# EAGLE design esp32_power_supply (EAGLE 9.6.2)
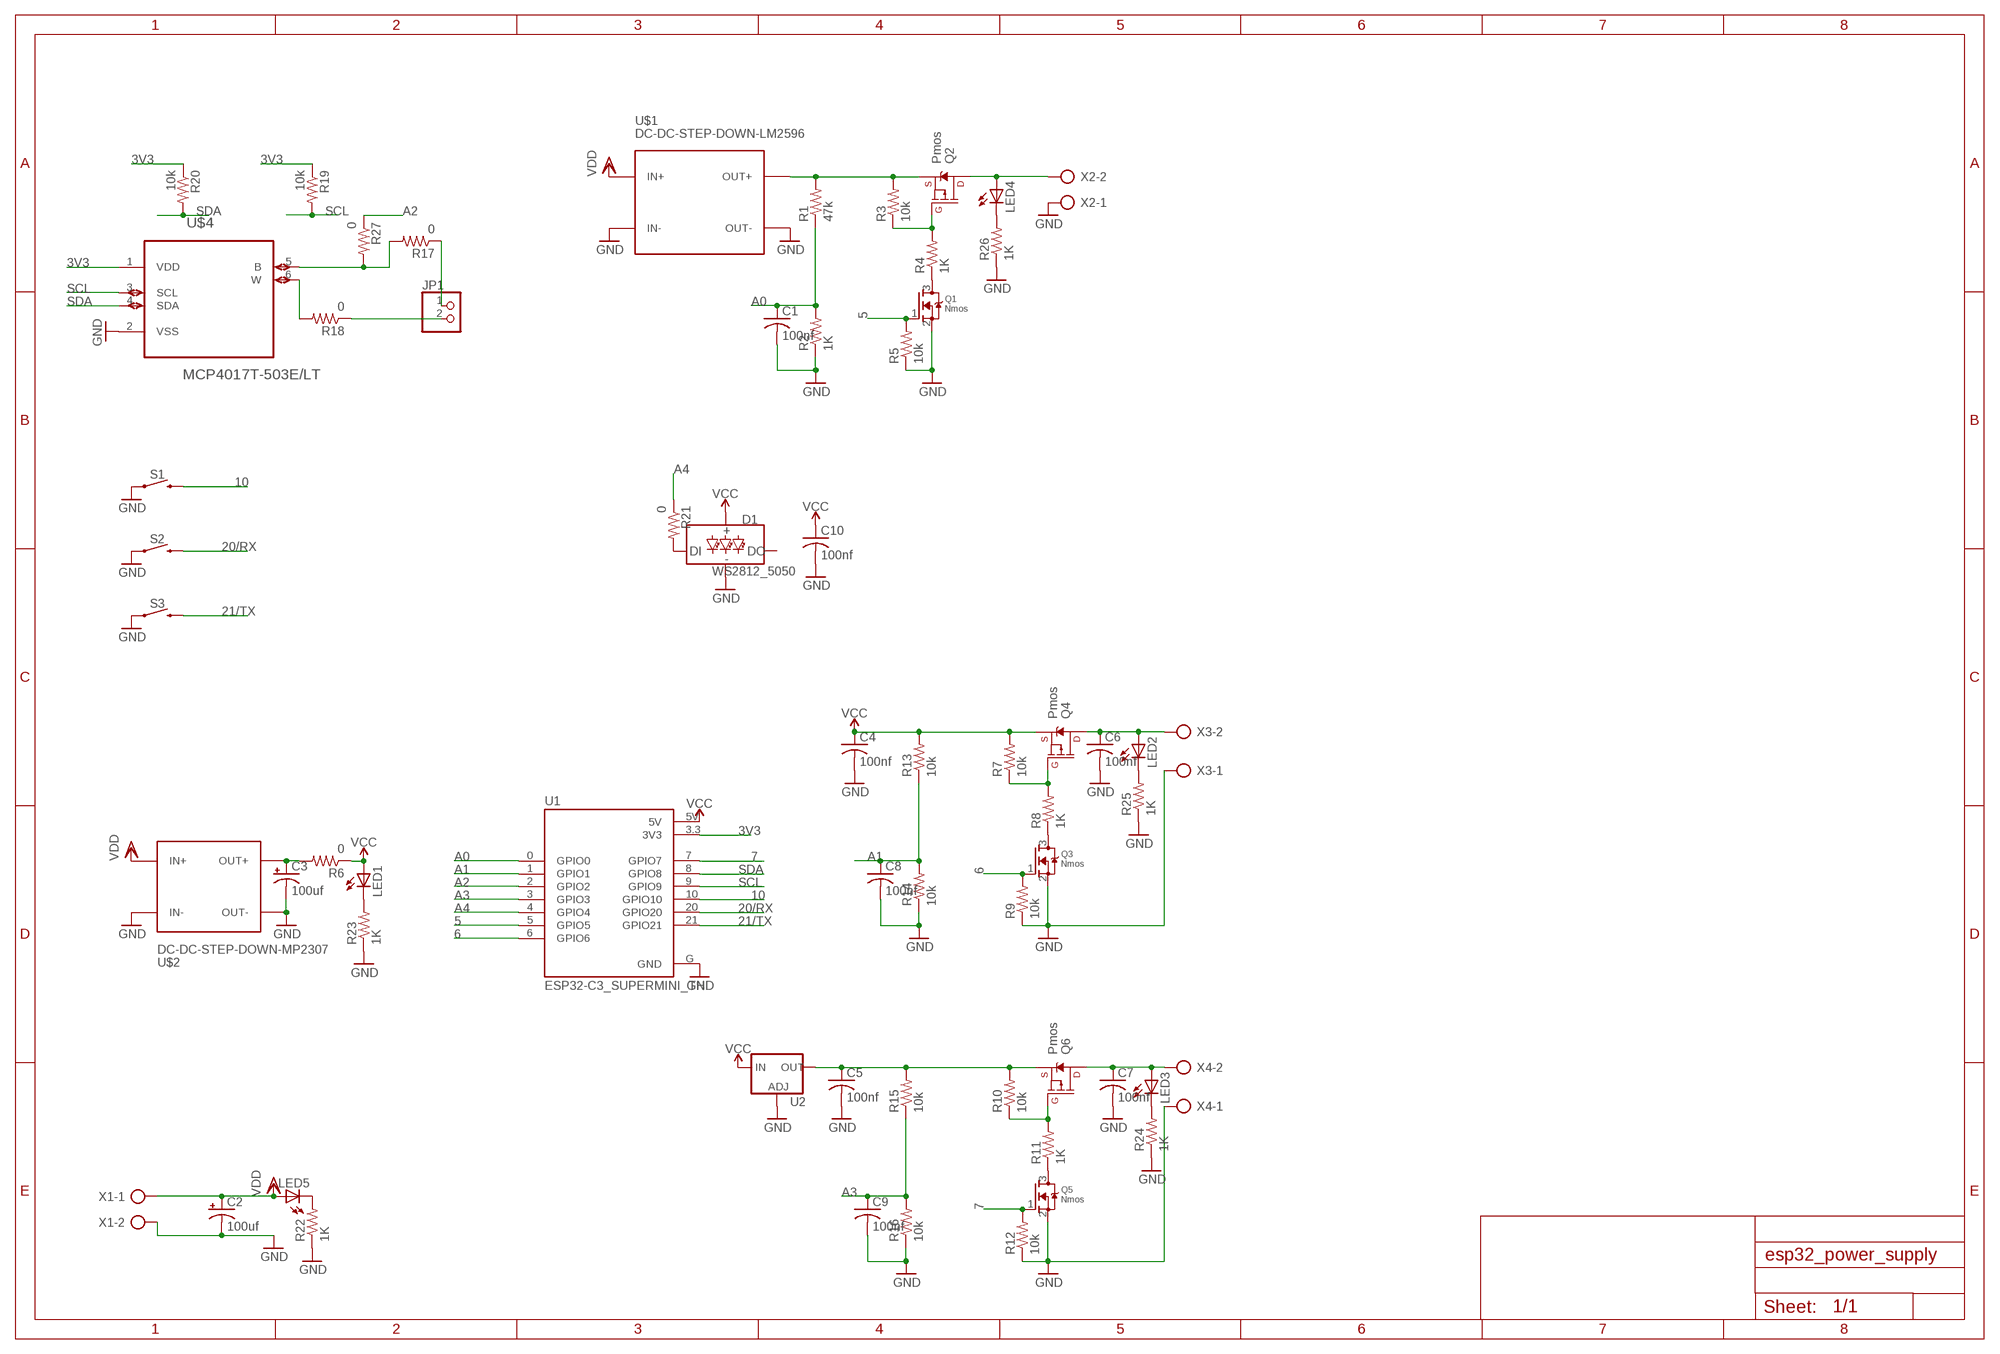
[diagram p0: schematic, sheet 1]

## Parts
C1  100nf  C-USC1206K  [C1206K]
C2  100uf  CPOL-USE3.5-10  [E3,5-10]
C3  100uf  CPOL-USE3.5-10  [E3,5-10]
C4  100nf  C-USC1206K  [C1206K]
C5  100nf  C-USC1206K  [C1206K]
C6  100nf  C-USC1206K  [C1206K]
C7  100nf  C-USC1206K  [C1206K]
C8  100nf  C-USC1206K  [C1206K]
C9  100nf  C-USC1206K  [C1206K]
C10  100nf  C-USC1206K  [C1206K]
D1  WS2812_5050  [WS2812-5X5-4PIN]
JP1  PINHD-1X2  [1X02]
LED1  LEDSMT1206  [1206]
LED2  LEDSMT1206  [1206]
LED3  LEDSMT1206  [1206]
LED4  LEDSMT1206  [1206]
LED5  LEDSMT1206  [1206]
Q1  Nmos  MOSFET-NREFLOW  [SOT23]
Q2  Pmos  MOSFET_PCH-SI2309DS  [SOT23-3]
Q3  Nmos  MOSFET-NREFLOW  [SOT23]
Q4  Pmos  MOSFET_PCH-SI2309DS  [SOT23-3]
Q5  Nmos  MOSFET-NREFLOW  [SOT23]
Q6  Pmos  MOSFET_PCH-SI2309DS  [SOT23-3]
R1  47k  R-US_M1206  [M1206]
R2  1K  R-US_M1206  [M1206]
R3  10k  R-US_M1206  [M1206]
R4  1K  R-US_M1206  [M1206]
R5  10k  R-US_M1206  [M1206]
R6  0  R-US_M1206  [M1206]
R7  10k  R-US_M1206  [M1206]
R8  1K  R-US_M1206  [M1206]
R9  10k  R-US_M1206  [M1206]
R10  10k  R-US_M1206  [M1206]
R11  1K  R-US_M1206  [M1206]
R12  10k  R-US_M1206  [M1206]
R13  10k  R-US_M1206  [M1206]
R14  10k  R-US_M1206  [M1206]
R15  10k  R-US_M1206  [M1206]
R16  10k  R-US_M1206  [M1206]
R17  0  R-US_M1206  [M1206]
R18  0  R-US_M1206  [M1206]
R19  10k  R-US_M1206  [M1206]
R20  10k  R-US_M1206  [M1206]
R21  0  R-US_M1206  [M1206]
R22  1K  R-US_M1206  [M1206]
R23  1K  R-US_M1206  [M1206]
R24  1K  R-US_M1206  [M1206]
R25  1K  R-US_M1206  [M1206]
R26  1K  R-US_M1206  [M1206]
R27  0  R-US_M1206  [M1206]
S1  MOMENTARY-SWITCH-SPST-PTH-6.0MM  [TACTILE_SWITCH_PTH_6.0MM]
S2  MOMENTARY-SWITCH-SPST-PTH-6.0MM  [TACTILE_SWITCH_PTH_6.0MM]
S3  MOMENTARY-SWITCH-SPST-PTH-6.0MM  [TACTILE_SWITCH_PTH_6.0MM]
U1  ESP32-C3_SUPERMINI_TH  [MODULE_ESP32-C3_SUPERMINI_TH]
U2  V_REG_LM1117SOT223  [SOT223]
U$1  DC-DC-STEP-DOWN-LM2596  [DC-DC-STEP-DOWN-LM2596]
U$2  DC-DC-STEP-DOWN-MP2307  [DC-DC-STEP-DOWN-MP2307]
U$4  MCP4017T-503E/LT  [SOT65P210X110-6N]
X1  AK500/2-H  [AK500/2-H]
X2  AK500/2-H  [AK500/2-H]
X3  AK500/2-H  [AK500/2-H]
X4  AK500/2-H  [AK500/2-H]

## Nets
3V3: R19.1 R20.1 U1.3.3(3V3) U$4.1(VDD)
5: Q1.1(G) R5.2 U1.5(GPIO5)
6: Q3.1(G) R9.2 U1.6(GPIO6)
7: Q5.1(G) R12.2 U1.7(GPIO7)
10: S1.3 U1.10(GPIO10)
20/RX: S2.3 U1.20(GPIO20)
21/TX: S3.3 U1.21(GPIO21)
A0: C1.1 R1.1 R2.2 U1.0(GPIO0)
A1: C8.1 R13.1 R14.2 U1.1(GPIO1)
A2: R27.1 U1.2(GPIO2)
A3: C9.1 R15.1 R16.2 U1.3(GPIO3)
A4: R21.1 U1.4(GPIO4)
GND: C1.2 C2.- C3.- C4.2 C5.2 C6.2 C7.2 C8.2 C9.2 C10.2 D1.GND Q1.2(S) Q3.2(S) Q5.2(S) R2.1 R5.1 R9.1 R12.1 R14.1 R16.1 R22.1 R23.1 R24.1 R25.1 R26.1 S1.1 S2.1 S3.1 U1.G(GND) U2.1(ADJ) U$1.IN- U$1.OUT- U$2.IN- U$2.OUT- U$4.2(VSS) X1.2 X2.1 X3.1 X4.1
N$1: Q2.2(S) R1.2 R3.2 U$1.OUT+
N$2: D1.DI R21.2
N$3: Q2.1(G) R3.1 R4.2
N$4: LED4.A Q2.3(D) X2.2
N$5: Q1.3(D) R4.1
N$6: LED5.C R22.2
N$7: C3.+ R6.2 U$2.OUT+
N$8: LED1.C R23.2
N$9: Q4.1(G) R7.1 R8.2
N$10: C6.1 LED2.A Q4.3(D) X3.2
N$11: Q3.3(D) R8.1
N$12: LED3.C R24.2
N$13: C5.1 Q6.2(S) R10.2 R15.2 U2.2(OUT) U2.4(OUT)
N$14: Q6.1(G) R10.1 R11.2
N$15: C7.1 LED3.A Q6.3(D) X4.2
N$16: Q5.3(D) R11.1
N$17: LED2.C R25.2
N$18: LED4.C R26.2
N$19: R17.2 R27.2 U$4.5(B)
N$22: R18.2 U$4.6(W)
N$24: JP1.1 R17.1
N$25: JP1.2 R18.1
SCL: R19.2 U1.9(GPIO9) U$4.3(SCL)
SDA: R20.2 U1.8(GPIO8) U$4.4(SDA)
VCC: C4.1 C10.1 D1.VCC LED1.A Q4.2(S) R6.1 R7.2 R13.2 U1.5V U2.3(IN)
VDD: C2.+ LED5.A U$1.IN+ U$2.IN+ X1.1
Unconnected: D1.DO

## Library data of the parts
C1 C4-C10 = adafruit:C-US: CAPACITOR, American symbol
C2 C3 = adafruit:CPOL-US: POLARIZED CAPACITOR, American symbol
D1 = SparkFun-LED:WS2812: Addressable RGB LED - 1 Wire Common names: WS2812, SK6812, Neopixel, APA-106, etc. SMD LED with built-in controller IC. Color: Red/Green/Blue SparkFun Products: LED-SMD RGB (WS2812) <https://www.sparkfun.com/products/11821> LED - RGB Addressable, PTH, 5mm Diffused (5 Pack) <https://www.sparkfun.com/products/12986> LED - RGB Addressable, PTH, 5mm Clear (5 Pack) <https://www.sparkfun.com/products/12999> Blynk Board - ESP8266 <https://www.sparkfun.com/products/13794> Datasheet referenced for footprint: WS2812B-PTH <https://cdn.sparkfun.com/datasheets/Components/LED/COM-12877.pdf>; PROD_ID: DIO-12503
JP1 = pinhead:PINHD-1X2: PIN HEADER
LED1-LED5 = adafruit:LED: LED OSRAM: - CHIPLED LG R971, LG N971, LY N971, LG Q971, LY Q971, LO R971, LY R971 LH N974, LH R974 LS Q976, LO Q976, LY Q976 LO Q996 - Hyper CHIPLED LW Q18S LB Q993, LB Q99A, LB R99A - SideLED LS A670, LO A670, LY A670, LG A670, LP A670 LB A673, LV A673, LT A673, LW A673 LH A674 LY A675 LS A676, LA A676, LO A676, LY A676, LW A676 LS A679, LY A679, LG A679 - Hyper Micro SIDELED® LS Y876, LA Y876, LO Y876, LY Y876 LT Y87S - SmartLED LW L88C, LW L88S LB L89C, LB L89S, LG L890 LS L89K, LO L89K, LY L89K LS L896, LA L896, LO L896, LY L896 - TOPLED LS T670, LO T670, LY T670, LG T670, LP T670 LSG T670, LSP T670, LSY T670, LOP T670, LYG T670 LG T671, LOG T671, LSG T671 LB T673, LV T673, LT T673, LW T673 LH T674 LS T676, LA T676, LO T676, LY T676, LB T676, LH T676, LSB T676, LW T676 LB T67C, LV T67C, LT T67C, LS T67K, LO T67K, LY T67K, LW E67C LS E67B, LA E67B, LO E67B, LY E67B, LB E67C, LV E67C, LT E67C LW T67C LS T679, LY T679, LG T679 LS T770, LO T770, LY T770, LG T770, LP T770 LB T773, LV T773, LT T773, LW T773 LH T774 LS E675, LA E675, LY E675, LS T675 LS T776, LA T776, LO T776, LY T776, LB T776 LHGB T686 LT T68C, LB T68C - Hyper Mini TOPLED® LB M676 - Mini TOPLED Santana® LG M470 LS M47K, LO M47K, LY M47K Source: http://www.osram.convergy.de/
Q1 Q3 Q5 = adafruit:MOSFET-N: N-Channel Mosfet 2N7002E - 60V 260mA SOT23 [Digikey: 2N7002ET1GOSTR-ND] - REEL BSH103 - 30V 850mA SOT23 [Digikey: 568-5013-1-ND]
Q2 Q4 Q6 = SparkFun-DiscreteSemi:MOSFET_PCH: P-channel MOSFETs Voltage controlled devices that allow control of high current outputs. SparkFun Products: SparkFun ESP32 Thing <https://www.sparkfun.com/products/13907> SparkFun ESP8266 Thing <https://www.sparkfun.com/products/13231> SparkFun Pi Servo HAT V2 <https://www.sparkfun.com/products/15316> DMG2305UX-7 (20V/4.2A/SOT23-3); PROD_ID: TRANS-08285; VALUE: 1.1A/60V/600mΩ
R1-R27 = adafruit:R-US_: RESISTOR, American symbol
S1-S3 = SparkFun-Switches:MOMENTARY-SWITCH-SPST: Momentary Switch (Pushbutton) - SPST Normally-open (NO) SPST momentary switches (buttons, pushbuttons). Variants PTH-12MM - 12mm square, through-hole Momentary Pushbutton Switch - 12mm Square <https://www.sparkfun.com/products/9190> (COM-09190) PTH-6.0MM, PTH-6.0MM-KIT - 6.0mm square, through-hole Mini Pushbutton Switch <https://www.sparkfun.com/products/97> (COM-00097) KIT package intended for soldering kit's - only one side of pads' copper is exposed. PTH-RIGHT-ANGLE-KIT - Right-angle, through-hole Right Angle Tactile Button <https://www.sparkfun.com/products/10791> - Used on SparkFun BigTime Watch Kit <https://www.sparkfun.com/products/11734> SMD-12MM - 12mm square, surface-mount Tactile Button - SMD (12mm) <https://www.sparkfun.com/products/12993> (COM-12993) Used on SparkFun PicoBoard <https://www.sparkfun.com/products/11888> SMD-4.5MM - 4.5mm Square Trackball Switch Used on SparkFun Blackberry Trackballer Breakout <https://www.sparkfun.com/products/13169> SMD-4.6MMX2.8MM - 4.60mm x 2.80mm, surface mount Used on SparkFun Pro Micro - RP2040 <https://www.sparkfun.com/products/17717> SMD-5.2MM, SMD-5.2-REDUNDANT - 5.2mm square, surface-mount Mini Pushbutton Switch - SMD <https://www.sparkfun.com/products/8720> (COM-08720) Used on Arduino Pro Mini <https://www.sparkfun.com/products/11114> REDUNDANT package connects both switch circuits together SMD-6.0X3.5MM - 6.0 x 3.5mm, surface mount Momentary Reset Switch SMD <https://www.sparkfun.com/products/8229> (COM-08229) SMD-6.2MM-TALL - 6.2mm square, surface mount Tactile Button - SMD (6mm) <https://www.sparkfun.com/products/12992> Used on SparkFun Digital Sandbox <https://www.sparkfun.com/products/12651> SMD-RIGHT-ANGLE - Right-angle, surface mount Used on SparkFun Block for Intel® Edison - Arduino <https://www.sparkfun.com/products/13036>; PROD_ID: SWCH-08441; SF_SKU: COM-00097
U1 = ESP32-C3_SUPERMINI_TH:ESP32-C3_SUPERMINI_TH: Check availability <https://pricing.snapeda.com/parts/ESP32-C3%20SuperMini_TH/Espressif%20Systems/view-part?ref=eda>; AVAILABILITY: Not in stock; CHECK_PRICES: https://www.snapeda.com/parts/ESP32-C3%20SuperMini_TH/Espressif+Systems/view-part/?ref=eda; DESCRIPTION: Super tiny ESP32-C3 board; MF: Espressif Systems; MP: ESP32-C3 SuperMini_TH; PACKAGE: Package; PRICE: None; SNAPEDA_LINK: https://www.snapeda.com/parts/ESP32-C3%20SuperMini_TH/Espressif+Systems/view-part/?ref=snap
U2 = SparkFun-IC-Power:V_REG_LM1117: Voltage Regulator LM1117 Standard adjustable voltage regulator but in SMD form. Spark Fun Electronics SKU : COM-00595; PROD_ID: VREG-08170
U$1 = diy-modules:DC-DC-STEP-DOWN-LM2596: DC/DC Step-Down Regulator based on LM2596-ADJ chip LM2596 datasheet available here: http://www.ti.com/lit/ds/symlink/lm2596.pdf Click here to find device on ebay.com <http://www.ebay.com/sch/lm2596+power+regulator>
U$2 = diy-modules:DC-DC-STEP-DOWN-MP2307: DC/DC Step-Down Regulator based on MP2307DN chip MP2307 datasheet available here: https://cdn-shop.adafruit.com/datasheets/MP2307_r1.9.pdf Click here to find device on ebay.com <http://www.ebay.com/sch/dc+dc+3a+mini+converter>
U$4 = MCP4017T-503E_LT:MCP4017T-503E/LT: Check availability <https://pricing.snapeda.com/parts/MCP4017T-503E/LT/Microchip/view-part?ref=eda>; AVAILABILITY: In Stock; CHECK_PRICES: https://www.snapeda.com/parts/MCP4017T-503E/LT/Microchip+Technology/view-part/?ref=eda; DESCRIPTION: MCP4017T-503E/LT,Digi Potentiometer 50kOhm 128-Pos Linear Serial-I2C 6-Pin SC-70 | Microchip Technology Inc. MCP4017T-503E/LT; MF: Microchip; MP: MCP4017T-503E/LT; PACKAGE: SC-70 Microchip; PRICE: None; SNAPEDA_LINK: https://www.snapeda.com/parts/MCP4017T-503E/LT/Microchip+Technology/view-part/?ref=snap
X1-X4 = con-ptr500:AK500/2-H: CONNECTOR Aug. 2004 / PTR Meßtechnik: Die Bezeichnung der Serie AK505 wurde geändert. Es handelt sich hierbei um AK500 in horizontaler Ausführung.; OC_FARNELL: unknown; OC_NEWARK: unknown

## Board
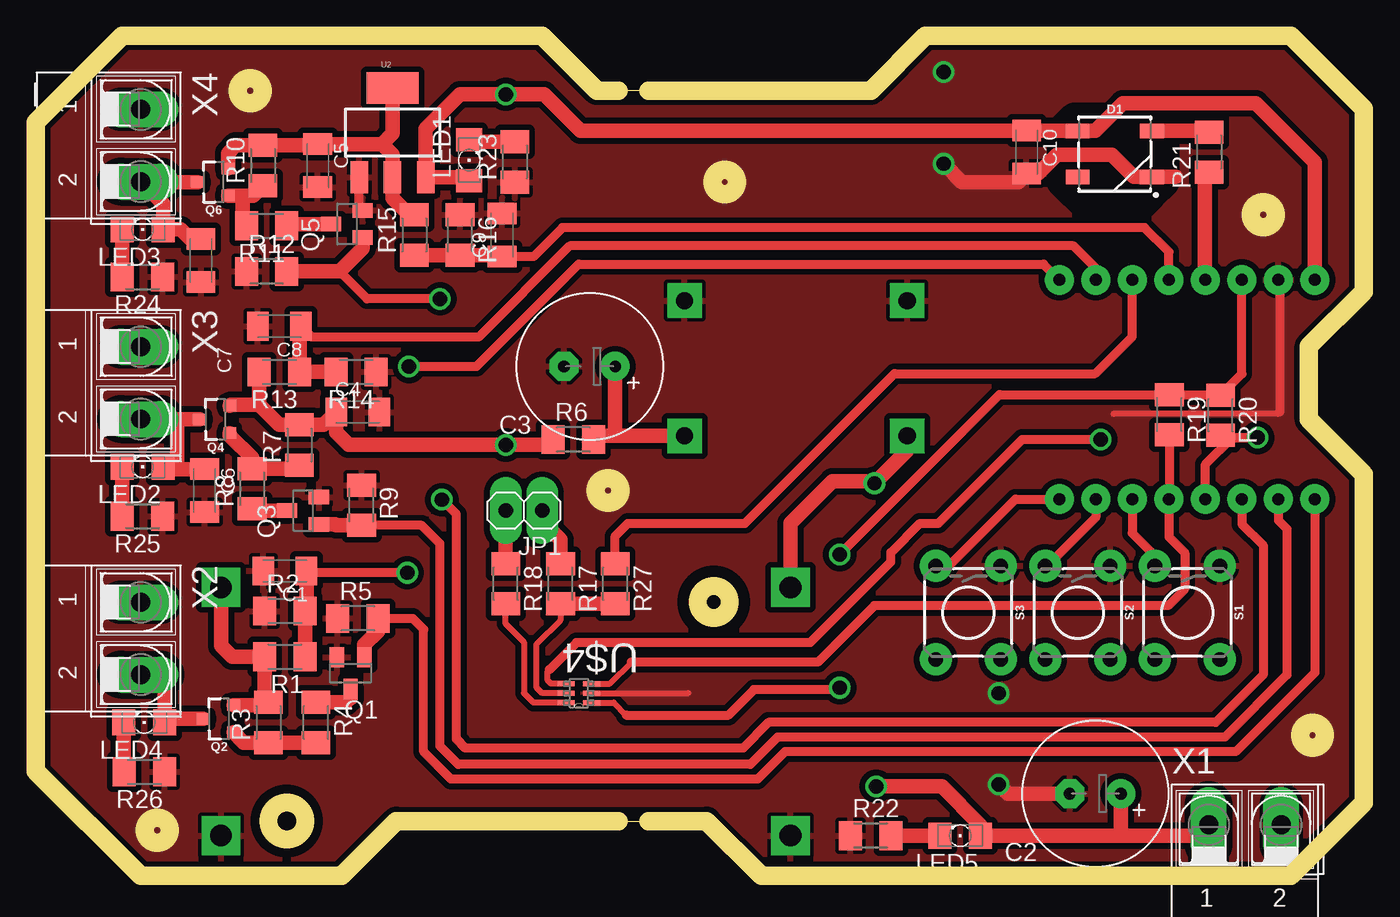
[diagram p1: board, top side]
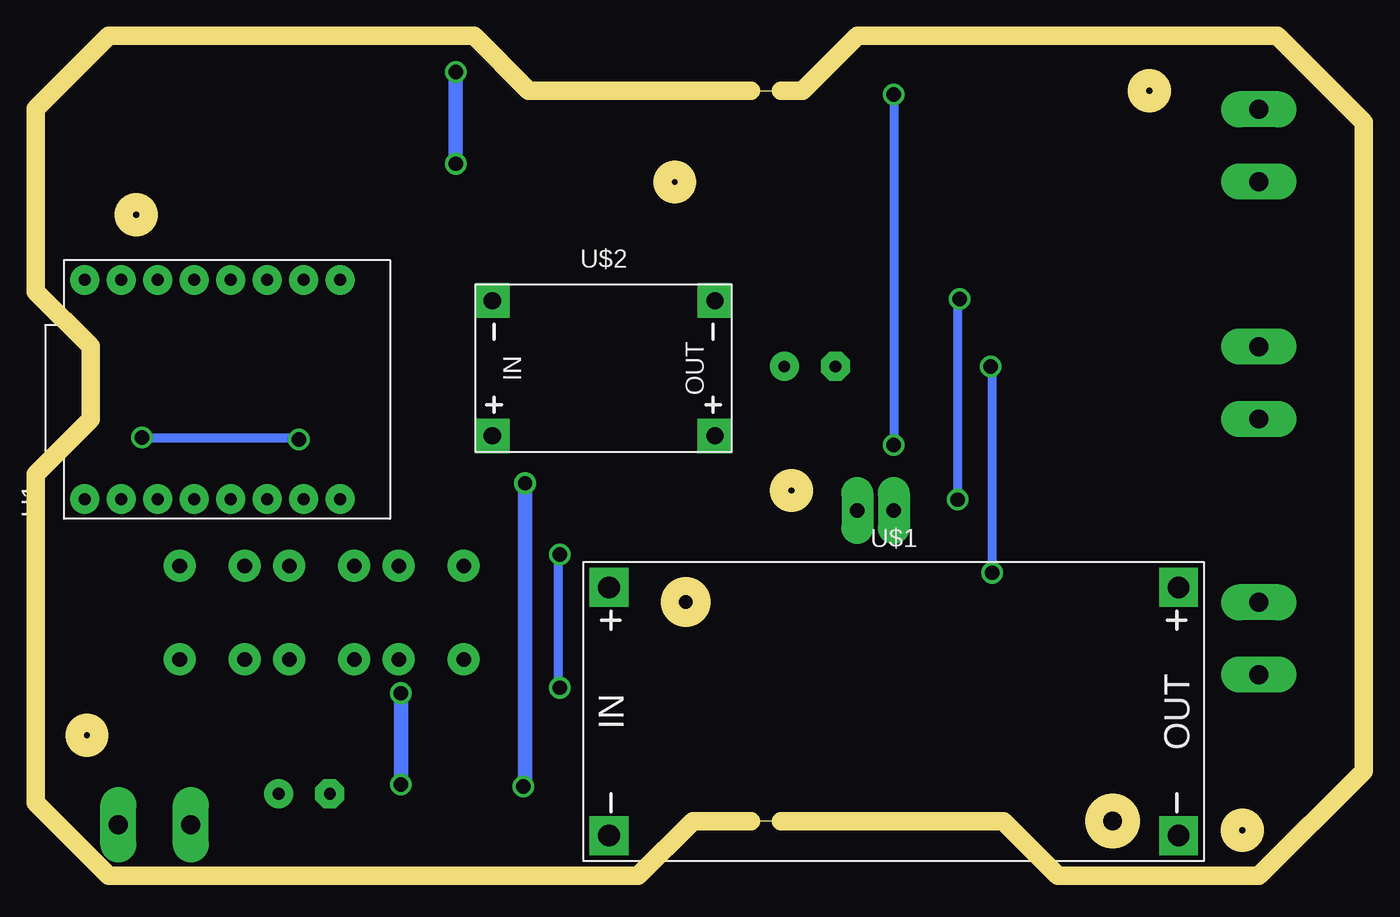
[diagram p2: board, bottom side, seen from below]

Size 92.38 x 58.42 mm. Coordinates in mm from the lower left corner, seen from the top.
Outline: 0,52.4 0,7.29 7.28,0.01 21.27,0.01 25.07,3.81 46.66,3.81 50.47,0 87.31,0.01 92.38,5.08 92.38,27.94 88.57,31.75 88.57,36.83 92.38,40.64 92.38,53.34 87.3,58.42 61.9,58.42 58.09,54.61 39.04,54.61 35.23,58.42 6.02,58.42 0,52.4
Copper layers (1*16): Top 0.035mm / dielectric 1.5mm / Bottom 0.035mm
Design rules "default *": minimum track width 0.4mm, minimum drill 1mm, track to track 0.3mm, track to pad 0.3mm, pad to pad 0.3mm, via to via 0.3mm, smd to smd 0.3mm, copper to edge 40mil, drill to drill 1mm, minimum pad ring 0.6mm, minimum via ring 8mil, stop-mask expansion 4mil, vias tented up to drill 0mil, thermal gap 10mil
tRestrict: area 71.4,46.5 to 78.5,52.8
Milling: area 16.2,2.5 to 18.7,5.1; area 46.1,18 to 48.3,20.1; area 14.1,53.8 to 15.8,55.5; area 47.1,47.4 to 48.8,49.1; area 84.5,45.1 to 86.2,46.8; area 39,25.9 to 40.7,27.6; area 7.6,2.3 to 9.3,4; area 88,8.9 to 89.7,10.6; 22 lines

### Footprints (pad centres in the part's own frame; a part is rotated, then mirrored left to right if it is on the bottom)
C1206K = smd 1.5 x 2: 1 -1.5,0; 2 1.5,0
E3,5-10 = drill 0.813 pad 1.6: + -1.778,0 | drill 0.813 pad 1.6 octagon: - 1.778,0
WS2812-5X5-4PIN = smd 1.651 x 1: DI 2.577,1.6; DO -2.577,-1.6; GND 2.577,-1.6; VCC -2.577,1.6
1X02 = drill 1.016 long: 1 -1.27,0; 2 1.27,0
1206 = smd 1.6 x 1.803: A -1.422,0; C 1.422,0
SOT23 = smd 1 x 1.4: 1 -0.95,-1.1; 2 0.95,-1.1; 3 0,1.1
SOT23-3 = smd 0.8 x 0.9: 1 -0.95,-1; 2 0.95,-1; 3 0,1.1
M1206 = smd 1.6 x 2: 1 -1.4,0; 2 1.4,0
TACTILE_SWITCH_PTH_6.0MM = drill 1.016 pad 1.88: 1 -3.251,2.261; 2 3.251,2.261; 3 -3.251,-2.261; 4 3.251,-2.261
MODULE_ESP32-C3_SUPERMINI_TH = drill 0.84: 0 7.62,-7.88; 1 7.62,-5.34; 2 7.62,-2.8; 3 7.62,-0.26; 3.3 7.62,4.82; 4 7.62,2.28; 5 -7.62,9.9; 5V 7.62,9.9; 6 -7.62,7.36; 7 -7.62,4.82; 8 -7.62,2.28; 9 -7.62,-0.26; 10 -7.62,-2.8; 20 -7.62,-5.34; 21 -7.62,-7.88; G 7.62,7.36
SOT223 = smd 1.219 x 2.235: 1 -2.311,-3.099; 2 0,-3.099; 3 2.311,-3.099 | smd 3.6 x 2.2: 4 0,3.099
DC-DC-STEP-DOWN-LM2596 = drill 1.5 pad 2.5 square: IN+ -19.812,8.636; IN- -19.812,-8.636; OUT+ 19.812,8.636; OUT- 19.812,-8.636 | hole 3: -14.478,7.62; 15.24,-7.62
DC-DC-STEP-DOWN-MP2307 = drill 1.2 pad 2 square: IN+ -7.747,-4.699; IN- -7.747,4.699; OUT+ 7.747,-4.699; OUT- 7.747,4.699
SOT65P210X110-6N = smd 1.168 x 0.356: 1 -0.889,0.66; 2 -0.889,0; 3 -0.889,-0.66; 4 0.889,-0.66; 5 0.889,0; 6 0.889,0.66
AK500/2-H = drill 1.321 long: 1 -2.515,0; 2 2.515,0

### Placement (x,y rotation side)
C1  17.32,21.21 180 top
C2  73.71,5.71 180 top
C3  38.53,35.43 180 top
C4  22.4,32.26 0 top
C5  19.61,49.4 270 top
C6  11.73,26.8 270 top
C7  11.48,42.8 270 top
C8  16.94,38.23 180 top
C9  32.44,44.58 90 top
C10  68.93,50.34 270 top
D1  75.06,50.21 0 top
JP1  33.96,25.4 180 top
LED1  30.15,49.78 90 top
LED2  7.42,28.45 180 top
LED3  7.42,44.96 180 top
LED4  7.54,10.67 180 top
LED5  64.31,2.79 180 top
Q1  21.9,14.1 180 top
Q2  12.75,10.92 90 top
Q3  18.59,25.4 90 top
Q4  12.5,31.75 90 top
Q5  21.64,45.34 90 top
Q6  12.37,48.26 90 top
R1  17.32,15.24 180 top
R2  17.32,18.41 0 top
R3  16.18,10.67 90 top
R4  19.48,10.67 270 top
R5  22.4,17.91 0 top
R6  37.39,30.35 0 top
R7  18.34,29.97 90 top
R8  15.04,26.92 90 top
R9  22.66,25.78 270 top
R10  15.8,49.4 90 top
R11  16.05,45.21 180 top
R12  16.05,42.04 0 top
R13  16.94,35.05 180 top
R14  22.28,35.05 180 top
R15  26.34,44.58 90 top
R16  29.52,44.58 270 top
R17  36.5,20.32 270 top
R18  32.69,20.32 270 top
R19  78.86,32.08 270 top
R20  82.42,32.03 270 top
R21  81.63,50.34 90 top
R22  58.09,2.79 0 top
R23  33.33,49.66 90 top
R24  7.42,41.66 180 top
R25  7.42,25.02 180 top
R26  7.54,7.24 180 top
R27  40.31,20.32 270 top
S1  80.12,18.31 270 top
S2  72.5,18.31 270 top
S3  64.88,18.31 270 top
U1  79.09,33.83 90 bottom
U2  24.82,51.69 0 top
U$1  32.69,11.43 0 bottom
U$2  52.88,35.31 0 bottom
U$4  37.77,12.7 180 top
X1  84.12,3.56 0 top
X2  7.29,16.51 270 top
X3  7.29,34.29 270 top
X4  7.29,50.8 270 top

### Tracks (layer width: path | path; a pad name or v marks a point on that pad's centre or on a via)
3V3  (via drill 1)
  Top 0.406: U$4.1 40.21,12.04 41.07,11.18
  Top 0.61: U1.3.3 83.91,34.92 R20.1 82.38,33.48 R19.1 67.06,33.48 v55.93,22.35 | 41.07,11.18 48.18,11.18 49.96,12.95 55.8,12.95 v55.93,13.08
  Bottom 0.61: v55.93,13.08 56.06,13.21 56.06,22.23 v55.93,22.35
5
  Top 0.61: R5.2 26.21,17.91 26.98,17.14 26.98,8.64 28.88,6.73 50.22,6.73 52.12,8.64 83.49,8.64 88.99,14.14 U1.5
  Top 1.016: R5.2 23.8,17.02 22.85,16.06 Q1.1
6
  Top 0.61: U1.6 86.45,24.73 87.05,24.13 87.05,13.97 82.73,9.65 51.61,9.65 49.71,7.75 29.39,7.75 28.12,9.02 28.12,23.11 26.85,24.38 R9.2
  Top 1.016: R9.2 20.88,24.38 20.81,24.45 Q3.1
7  (via drill 1)
  Top 0.61: U1.7 83.91,24.47 85.39,22.99 85.39,13.97 82.09,10.67 50.98,10.67 49.2,8.89 29.9,8.89 29.26,9.53 29.26,25.15 v28.25,26.16 | v28.12,40.13 23.04,40.13 21.13,42.04
  Top 1.016: R12.2 21.13,42.04 22.74,43.64 Q5.1
  Bottom 0.61: v28.25,26.16 28.25,40 v28.12,40.13
10
  Top 0.61: U1.10 76.29,23.84 77.86,22.27 S1.3
20/RX
  Top 0.61: U1.20 73.75,24.94 70.37,21.56 S2.3
21/TX
  Top 0.61: S3.3 63.52,21.56 68.17,26.21 U1.21
A0  (via drill 1)
  Top 0.61: v25.83,21.08 18.95,21.08 C1.1 | v25.96,35.43 30.66,35.43 37.77,42.54 70.11,42.54 U1.0
  Top 1.016: R1.1 R2.2 18.82,18.52 C1.1
  Bottom 0.61: v25.83,21.08 25.83,35.31 v25.96,35.43
A1
  Top 0.61: U1.1 73.75,42.25 72.19,43.81 37.14,43.81 30.79,37.46 19.2,37.46 C8.1
  Top 1.016: C8.1 18.34,38.13 R13.1 R14.2
A2
  Top 0.61: R27.1 40.31,23.62 41.2,24.51 49.33,24.51 59.74,34.92 73.71,34.92 76.29,37.5 U1.2
A3
  Top 0.61: U1.3 78.83,43.39 77.14,45.08 36.63,45.08 34.62,43.08 C9.1
  Top 1.016: R15.1 R16.2 32.34,43.18 C9.1
A4
  Top 1.016: U1.4 81.33,41.49 81.33,48.64 R21.1
GND  (via drill 1)
  Top 0.406: U$4.2 45.39,12.7 | 74.98,32.13 81.21,32.13 81.22,32.13 86.41,32.13 86.54,32.26
  Top 0.61: Q5.2 22.51,46.52 U2.1 | U1.G 86.54,41.36 86.54,32.26
  Top 1.016: C2.- 67.61,5.71 v66.98,6.35 | v63.17,49.53 64.44,48.26 68.35,48.26 C10.2 69.72,48.84 71.04,50.16 74.85,50.16 76.41,48.61 D1.GND 79.33,48.61 | v63.17,55.91 63.17,55.88
  Bottom 1.016: v66.98,6.35 v66.98,12.7 | v63.17,49.53 v63.17,55.91
  pour Top (isolate 0.406): 106.35,80.01 -0.33,80.01 -0.33,-1.27 106.35,-1.27
N$1
  Top 1.016: Q2.2 15.98,11.87 R3.2 15.92,12.33 R1.2 13.64,15.24 12.88,16 U$1.OUT+
N$2
  Top 1.016: R21.2 81.56,51.81 D1.DI
N$3
  Top 1.016: R4.2 R3.1 14.46,9.27 Q2.1
N$4
  Top 1.016: X2.2 7.9,14 8.97,12.93 LED4.A 9.22,10.92 Q2.3
N$5
  Top 1.016: Q1.3 21.9,12.36 21.6,12.07 R4.1
N$6
  Top 1.016: R22.2 59.51,2.78 LED5.C
N$7
  Top 1.016: C3.+ 40.31,30.6 | R6.2 39.04,30.6 40.31,30.6 | U$2.OUT+ 40.31,30.6
N$8
  Top 1.016: LED1.C 30.3,51.06 R23.2
N$9
  Top 1.016: Q4.1 13.5,30.63 15.04,29.09 R8.2 18.09,28.32 R7.1
N$10
  Top 1.016: X3.2 9.83,31.78 | 9.83,31.78 11.37,31.78 Q4.3 | C6.1 9.83,28.3 | 9.83,28.3 8.99,28.3 LED2.A | 9.83,31.78 9.83,28.3
N$11
  Top 1.016: Q3.3 15.16,25.4 R8.1
N$12
  Top 1.016: R24.2 6.02,44.94 LED3.C
N$13
  Top 1.016: Q6.2 13.37,50.28 13.9,50.8 R10.2 19.51,50.8 C5.1 24.08,50.9 | 24.08,50.9 24.82,50.16 U2.2 24.82,47.12 25.96,45.98 R15.2 | U2.4 24.82,51.64 24.08,50.9
N$14
  Top 1.016: Q6.1 14.4,47.31 | 14.4,47.31 15.11,47.31 R10.1 | R11.2 14.4,45.46 14.4,47.31
N$15
  Top 1.016: Q6.3 7.31,48.26 X4.2 8.84,46.74 LED3.A 10.08,44.96 10.74,44.3 C7.1
N$16
  Top 1.016: R11.1 17.58,45.34 Q5.3
N$17
  Top 1.016: LED2.C 6,25.04 R25.2
N$18
  Top 1.016: LED4.C 6.12,7.26 R26.2
N$19
  Top 0.406: U$4.5 35.23,12.7 34.85,13.08 34.85,16.13 36.5,17.78 R17.2
  Top 1.016: R17.2 R27.2
N$22
  Top 0.406: U$4.6 34.62,12.04 33.96,12.7 33.96,16.25 32.69,17.52 R18.2
N$24
  Top 1.016: JP1.1 35.23,24.64 36.5,23.37 R17.1
N$25
  Top 1.016: JP1.2 R18.1
SCL
  Top 0.406: 41.43,14.86 39.93,13.36 U$4.3
  Top 0.61: 41.43,14.86 54.41,14.86 58.34,18.8 78.79,18.8 79.93,19.94 79.93,22.48 78.83,23.58 U1.9 78.86,26.24 R19.2
SDA  (via drill 1)
  Top 0.406: U$4.4 35.84,13.36 35.61,13.59 35.61,14.22 35.74,14.35
  Top 0.61: 35.74,14.35 37.62,16.23 53.87,16.23 59.49,21.84 59.49,22.48 61.52,24.51 62.79,24.51 68.63,30.35 v74.09,30.35 | R20.2 82.58,30.48 v85.01,30.48 83.24,30.48 81.37,28.61 U1.8
  Bottom 0.61: v85.01,30.48 74.22,30.48 v74.09,30.35
VCC  (via drill 1)
  Top 1.016: 15.54,32.77 R13.2 | 15.54,32.77 16.94,31.37 R7.2 20.02,31.37 C4.1 20.9,30.84 21.77,29.97 v32.69,29.97 35.61,29.97 R6.1 | Q4.2 13.57,32.77 15.54,32.77 | LED1.A 29.92,48.59 U2.3 27.13,51.97 29.52,54.36 v32.69,54.36 35.36,54.36 37.9,51.81 68.96,51.81 | 68.96,51.81 D1.VCC 73.7,51.81 75.62,53.72 84.89,53.72 88.99,49.62 U1.5V | C10.1 68.96,51.81
  Bottom 0.61: v32.69,54.36 v32.69,29.97
VDD  (via drill 1)
  Top 1.016: U$2.IN+ 60.63,29.59 v58.34,27.3 58.22,27.43 55.42,27.43 52.5,24.51 U$1.IN+ | 75.36,2.79 LED5.A 65.73,3.53 63.04,6.22 v58.47,6.22 | 75.36,2.79 80.85,2.79 X1.1 | C2.+ 75.49,2.92 75.36,2.79
  Bottom 1.016: v58.34,27.3 58.34,6.35 v58.47,6.22